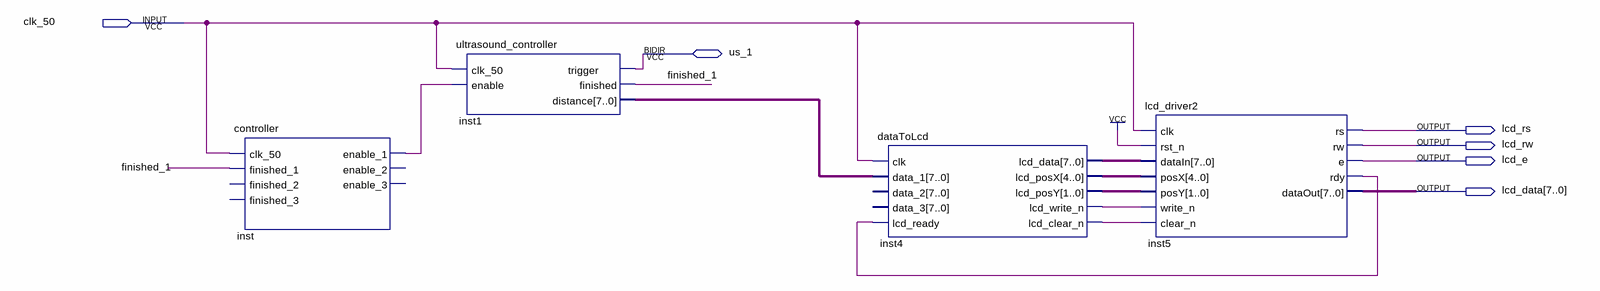
[diagram p0: schematic sheet]
// Quartus schematic ultrasound_reader.bdf as structural Verilog: 4 symbols, 6 pins
module ultrasound_reader (
  input  clk_50,
  inout  us_1,
  output lcd_rs,
  output lcd_rw,
  output lcd_e,
  output [7:0] lcd_data
);

  wire finished_1, inst4_lcd_clear_n, inst4_lcd_write_n, inst5_rdy, inst_enable_1;
  wire [1:0] inst4_lcd_posy;
  wire [4:0] inst4_lcd_posx;
  wire [7:0] inst1_distance, inst4_lcd_data;

  controller inst (
    .clk_50(clk_50), .finished_1(finished_1), .enable_1(inst_enable_1));  // open: finished_2, finished_3, enable_2, enable_3
  ultrasound_controller inst1 (
    .clk_50(clk_50), .enable(inst_enable_1), .finished(finished_1), .distance(inst1_distance), .trigger(us_1));
  dataToLcd inst4 (
    .clk(clk_50), .data_1(inst1_distance), .lcd_ready(inst5_rdy), .lcd_data(inst4_lcd_data),
    .lcd_posX(inst4_lcd_posx), .lcd_posY(inst4_lcd_posy), .lcd_write_n(inst4_lcd_write_n),
    .lcd_clear_n(inst4_lcd_clear_n));  // open: data_2, data_3
  lcd_driver2 inst5 (
    .clk(clk_50), .rst_n(1'b1), .dataIn(inst4_lcd_data), .posX(inst4_lcd_posx), .posY(inst4_lcd_posy),
    .write_n(inst4_lcd_write_n), .clear_n(inst4_lcd_clear_n), .rs(lcd_rs), .rw(lcd_rw), .e(lcd_e),
    .rdy(inst5_rdy), .dataOut(lcd_data));
endmodule
